# EAGLE design AQ_sensor_GSM (EAGLE 9.6.2)

## Sheet 1 of 2
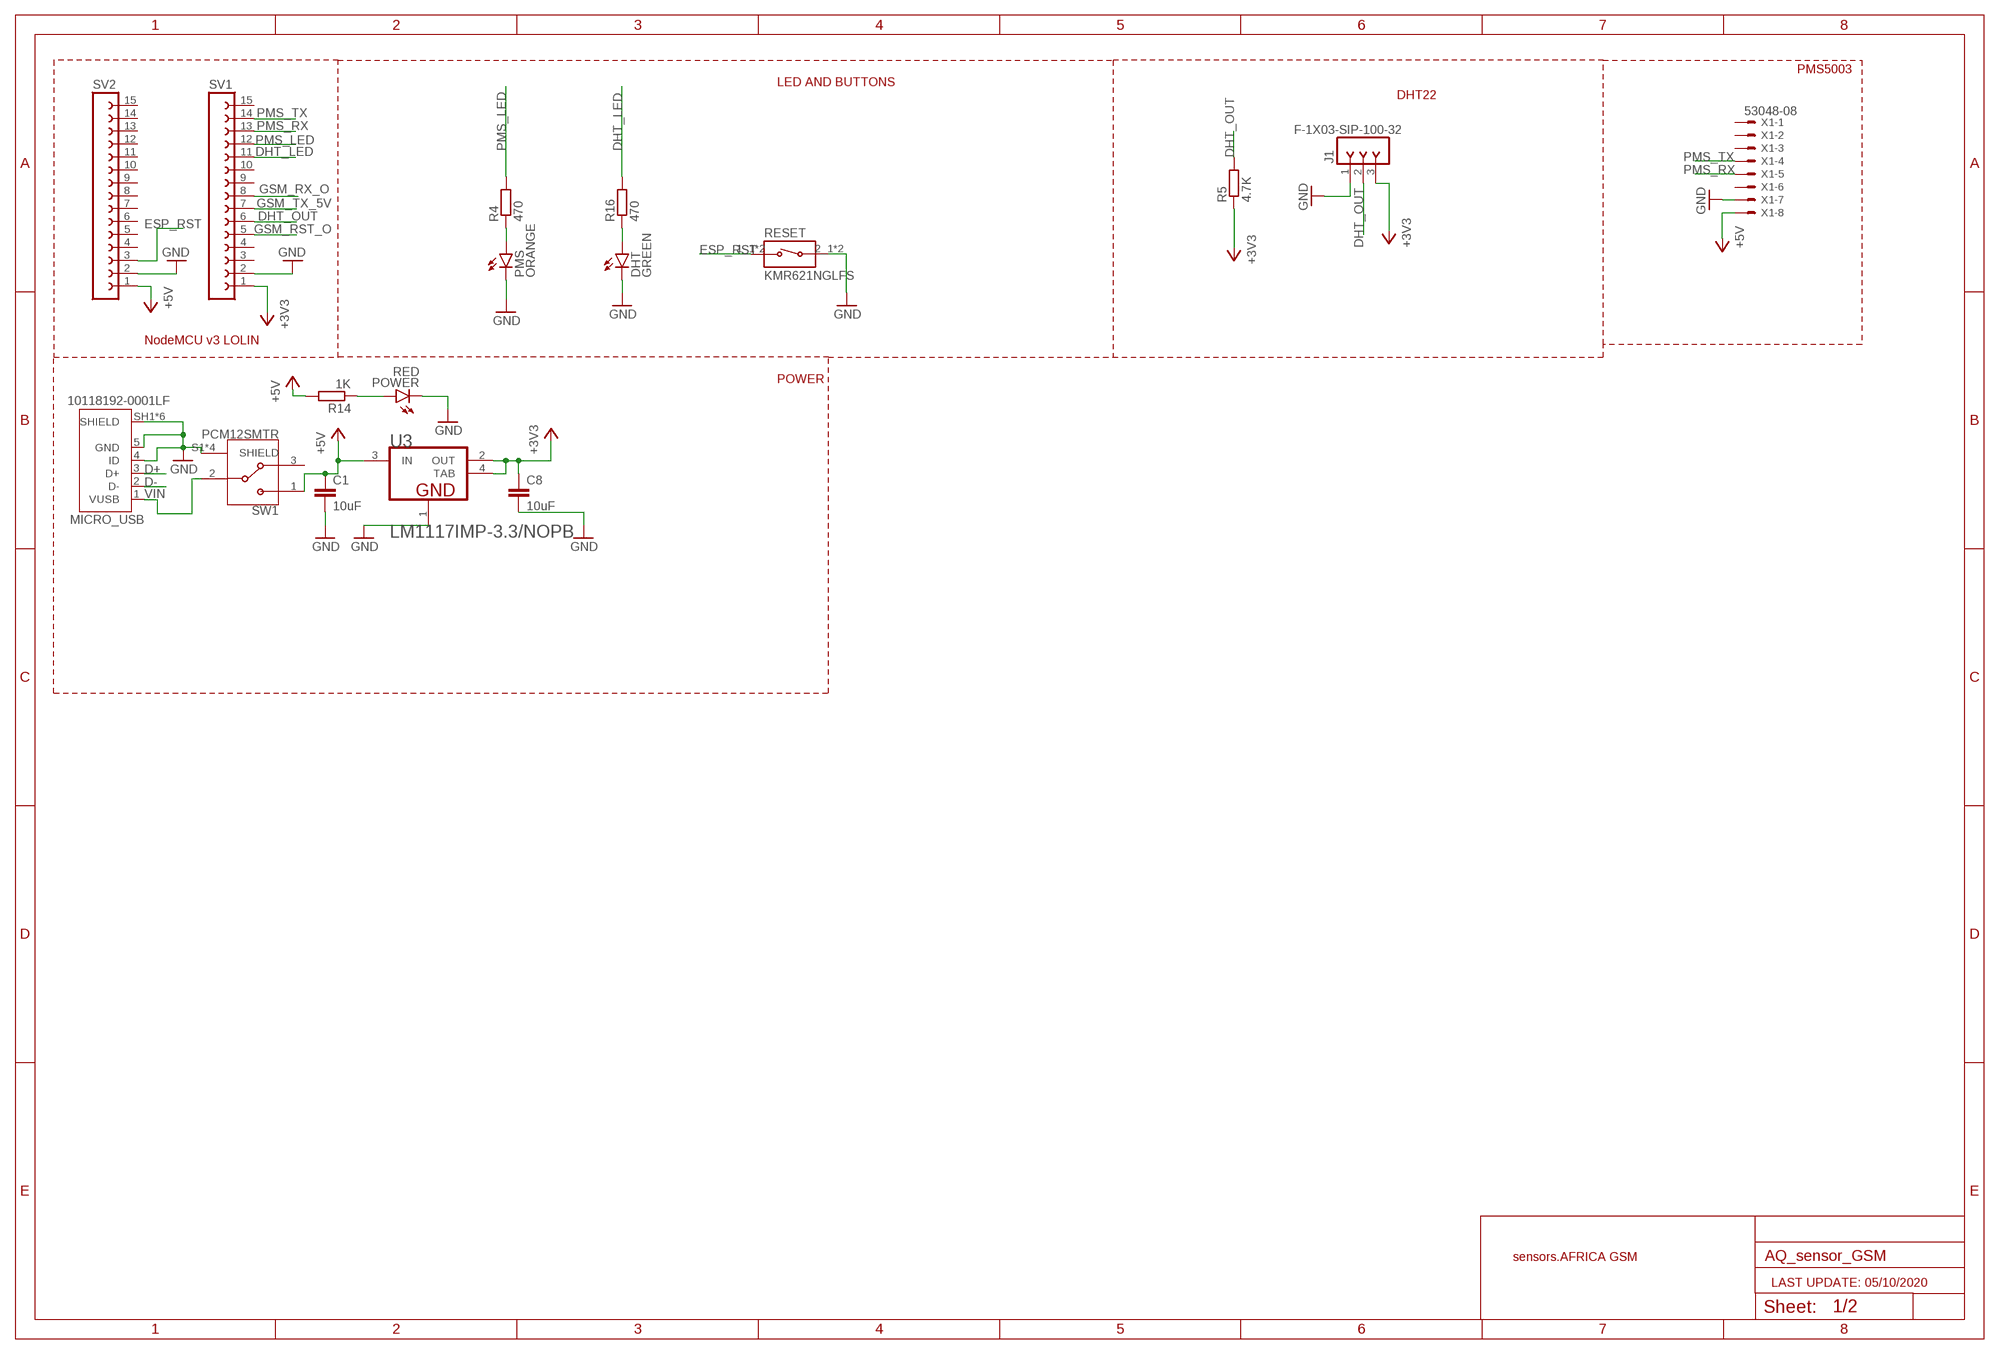
[diagram p0: schematic, sheet 1]

### Parts
C1  10uF  C-EUC0603  [C0603]
C8  10uF  C-EUC0603  [C0603]
DHT  GREEN  LEDCHIP-LED0603  [CHIP-LED0603]
J1  F-1X03-SIP-100-32  [SIP-100-03-32]
MICRO_USB  10118192-0001LF  [AMPHENOL_10118192-0001LF]
PMS  ORANGE  LEDCHIP-LED0603  [CHIP-LED0603]
POWER  RED  LEDCHIP-LED0603  [CHIP-LED0603]
R4  470  R-EU_R0603  [R0603]
R5  4.7K  R-EU_R0603  [R0603]
R14  1K  R-EU_R0603  [R0603]
R16  470  R-EU_R0603  [R0603]
RESET  KMR621NGLFS  [SW_KMR621NGLFS]
SV1  FE15-1  [FE15]
SV2  FE15-1  [FE15]
SW1  PCM12SMTR  [SW_PCM12SMTR]
U3  TEXAS_INSTRUMENTS_LM1117IMP-3.3-NOPBTEXAS_INSTRUMENTS_LM1117IMP-3.3-NOPB_0_0  [TEXAS_INSTRUMENTS_LM1117IMP-3.3-NOPB_0]
X1  53048-08  [53048-08]

### Nets
+3V3 [POWER]: C8.1 J1.3 R5.1 SV1.1 U3.2(OUT) U3.4(TAB)
+5V [POWER]: C1.1 R14.2 SV2.1 SW1.1 U3.3(IN) X1.8 ; also sheet 2
D+: MICRO_USB.3(D+)
D-: MICRO_USB.2(D-)
DHT_LED: R16.2 SV1.11
DHT_OUT: J1.2 R5.2 SV1.6
ESP_RST: RESET.1_1 RESET.1_2 SV2.3
GND [BGA]: C1.2 C8.2 DHT.C J1.1 MICRO_USB.4(ID) MICRO_USB.5(GND) MICRO_USB.SH1(SHIELD) MICRO_USB.SH2(SHIELD) MICRO_USB.SH3(SHIELD) MICRO_USB.SH4(SHIELD) MICRO_USB.SH5(SHIELD) MICRO_USB.SH6(SHIELD) PMS.C POWER.C RESET.2_1 RESET.2_2 SV1.2 SV2.2 SW1.S1(SHIELD) SW1.S2(SHIELD) SW1.S3(SHIELD) SW1.S4(SHIELD) U3.1(GND) X1.7 ; also sheet 2
GSM_RST_O: SV1.5
GSM_RX_O: SV1.8 ; also sheet 2
GSM_TX_5V: SV1.7 ; also sheet 2
N$4: PMS.A R4.1
N$25: POWER.A R14.1
N$27: DHT.A R16.1
PMS_LED: R4.2 SV1.12
PMS_RX: SV1.13 X1.5
PMS_TX: SV1.14 X1.4
VIN: MICRO_USB.1(VUSB) SW1.2
Unconnected: SV1.3 SV1.4 SV1.9 SV1.10 SV1.15 SV2.4 SV2.5 SV2.6 SV2.7 SV2.8 SV2.9 SV2.10 SV2.11 SV2.12 SV2.13 SV2.14 SV2.15 SW1.3 X1.1 X1.2 X1.3 X1.6

### Notes on the sheet
- PMS5003
- LED AND BUTTONS
- DHT22
- NodeMCU v3 LOLIN
- POWER
- sensors.AFRICA GSM
- LAST UPDATE: 05/10/2020

## Sheet 2 of 2
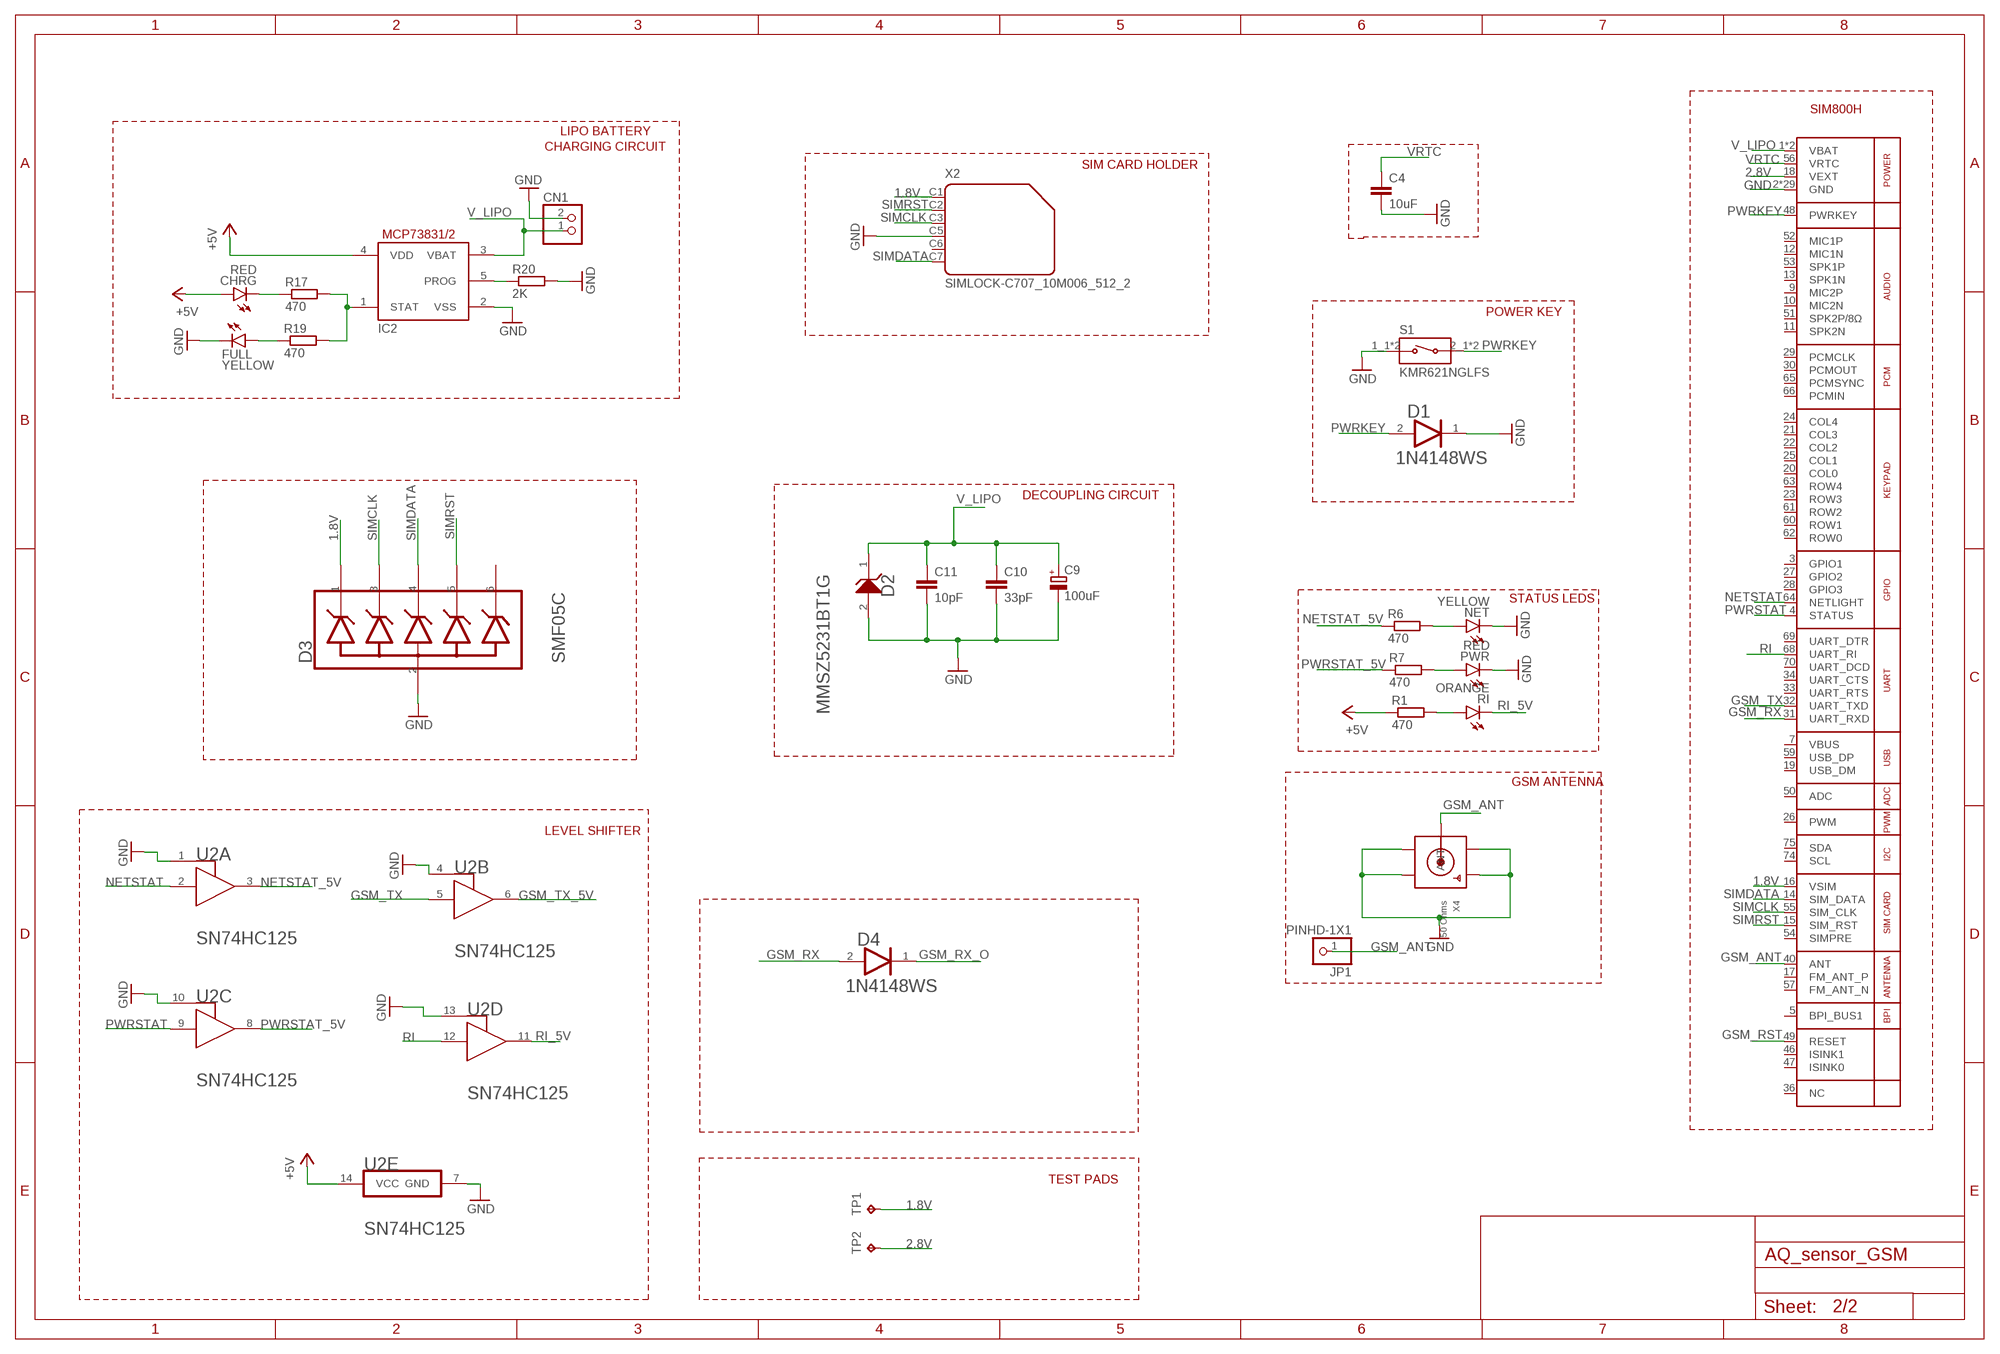
[diagram p1: schematic, sheet 2]

### Parts
C4  10uF  C-EUC0603  [C0603]
C9  100uF  CPOL-EUD  [PANASONIC_D]
C10  33pF  C-EUC0603  [C0603]
C11  10pF  C-EUC0603  [C0603]
CHRG  RED  LEDCHIP-LED0603  [CHIP-LED0603]
CN1  JST_2PIN-SMT-RA  [JST-PH-2-SMT-RA]
D1  ON_SEMI_1N4148WSON_SEMI_1N4148WS_0_0  [ON_SEMI_1N4148WS_0]
D2  ON_SEMICONDUCTOR_MMSZ5231BT1GON_SEMICONDUCTOR_MMSZ5231BT1G_0_0  [ON_SEMICONDUCTOR_MMSZ5231BT1G_0]
D3  SEMTECH_SMF05CSEMTECH_SMF05C_0_0  [SEMTECH_SMF05C_0]
D4  ON_SEMI_1N4148WSON_SEMI_1N4148WS_0_0  [ON_SEMI_1N4148WS_0]
FULL  YELLOW  LEDCHIP-LED0603  [CHIP-LED0603]
IC2  MCP73831/OT  [SOT23-5L]
JP1  PINHD-1X1  [1X01]
NET  YELLOW  LEDCHIP-LED0603  [CHIP-LED0603]
PWR  RED  LEDCHIP-LED0603  [CHIP-LED0603]
R1  470  R-EU_R0603  [R0603]
R6  470  R-EU_R0603  [R0603]
R7  470  R-EU_R0603  [R0603]
R17  470  R-EU_R0603  [R0603]
R19  470  R-EU_R0603  [R0603]
R20  2K  R-EU_R0603  [R0603]
RI  ORANGE  LEDCHIP-LED0603  [CHIP-LED0603]
S1  KMR621NGLFS  [SW_KMR621NGLFS]
TP1  TPB1,27  [B1,27]
TP2  TPB1,27  [B1,27]
U1  GSM_SIM800L  [SIM800L]
U2  TEXAS_INSTRUMENTS_SN74HC125TEXAS_INSTRUMENTS_SN74HC125_0_0  [TEXAS_INSTRUMENTS_SN74HC125_0]
X2  SIMLOCK-C707_10M006_512_2  [C707_10M006_512_2]
X4  50 Ohms  SMACONNECTOR_EDGE_UFL  [SMA_EDGELAUNCH_UFL]

### Nets
1.8V: D3.1(1_CATHODE) TP1.TP U1.16(VSIM) X2.C1
2.8V: TP2.TP U1.18(VEXT)
+5V [POWER]: CHRG.A IC2.4(VDD) R1.1 U2.14(E:VCC) ; also sheet 1
GND [BGA]: C4.2 C9.- C10.2 C11.2 CN1.2 D1.1(CATHODE) D2.2(A) D3.2(ANODE) FULL.C IC2.2(VSS) NET.C PWR.C R20.2 S1.1_1 S1.1_2 U1.2(GND) U1.6(GND) U1.8(GND) U1.35(GND) U1.37(GND) U1.38(GND) U1.39(GND) U1.41(GND) U1.43(GND) U1.44(GND) U1.45(GND) U1.58(GND) U1.67(GND) U1.71(GND) U1.72(GND) U1.73(GND) U1.76(GND) U1.77(GND) U1.78(GND) U1.79(GND) U1.80(GND) U1.81(GND) U1.82(GND) U1.83(GND) U1.84(GND) U1.85(GND) U1.86(GND) U1.87(GND) U1.88(GND) U2.1(A:1_!OE!) U2.4(B:4_!OE!) U2.7(E:GND) U2.10(C:2_!OE!) U2.13(D:3_!OE!) X2.C5 X4.GND@1(GND1) X4.GND@2(GND2) X4.GND@3(GND3) X4.GND@4(GND4) ; also sheet 1
GSM_ANT: JP1.1 U1.40(ANT) X4.P(ANT)
GSM_RST [BGA]: U1.49(RESET)
GSM_RX: D4.2(ANODE) U1.31(UART_RXD)
GSM_RX_O: D4.1(CATHODE) ; also sheet 1
GSM_TX: U1.32(UART_TXD) U2.5(B:2A)
GSM_TX_5V: U2.6(B:2Y) ; also sheet 1
N$6: CHRG.C R17.1
N$9: IC2.1(STAT) R17.2 R19.2
N$10: NET.A R6.2
N$11: PWR.A R7.2
N$12: FULL.A R19.1
N$13: IC2.5(PROG) R20.1
N$14: R1.2 RI.A
NETSTAT [BGA]: U1.64(NETLIGHT) U2.2(A:1A)
NETSTAT_5V: R6.1 U2.3(A:1Y)
PWRKEY [BGA]: D1.2(ANODE) S1.2_1 S1.2_2 U1.48(PWRKEY)
PWRSTAT: U1.4(STATUS) U2.9(C:3A)
PWRSTAT_5V: R7.1 U2.8(C:3Y)
RI [BGA]: U1.68(UART_RI) U2.12(D:4A)
RI_5V: RI.C U2.11(D:4Y)
SIMCLK [BGA]: D3.3(2_CATHODE) U1.55(SIM_CLK) X2.C3
SIMDATA: D3.4(3_CATHODE) U1.14(SIM_DATA) X2.C7
SIMRST: D3.5(4_CATHODE) U1.15(SIM_RST) X2.C2
V_LIPO: C9.+ C10.1 C11.1 CN1.1 D2.1(K) IC2.3(VBAT) U1.1(VBAT) U1.42(VBAT)
VRTC [BGA]: C4.1 U1.56(VRTC)
Unconnected: D3.6(5_CATHODE) U1.3(GPIO1) U1.5(BPI_BUS1) U1.9(MIC2P) U1.10(MIC2N) U1.11(SPK2N) U1.12(MIC1N) U1.13(SPK1N) U1.17(FM_ANT_P) U1.19(USB_DM) U1.20(COL0) U1.21(COL3) U1.22(COL2) U1.23(ROW3) U1.24(COL4) U1.25(COL1) U1.26(PWM) U1.27(GPIO2) U1.28(GPIO3) U1.29(PCMCLK) U1.30(PCMOUT) U1.33(UART_RTS) U1.34(UART_CTS) U1.36(NC) U1.46(ISINK1) U1.47(ISINK0) U1.50(ADC) U1.51(SPK2P/8Ω) U1.52(MIC1P) U1.53(SPK1P) U1.54(SIMPRE) U1.57(FM_ANT_N) U1.59(USB_DP) U1.60(ROW1) U1.61(ROW2) U1.62(ROW0) U1.63(ROW4) U1.65(PCMSYNC) U1.66(PCMIN) U1.69(UART_DTR) U1.70(UART_DCD) U1.74(SCL) U1.75(SDA) X2.C6

### Notes on the sheet
- SIM800H
- LIPO BATTERY
- CHARGING CIRCUIT
- SIM CARD HOLDER
- POWER KEY
- DECOUPLING CIRCUIT
- STATUS LEDS
- GSM ANTENNA
- LEVEL SHIFTER
- TEST PADS

## Power pins joined to a net without a drawn wire
VBUS: U1.7(VBUS)

## Library data of the parts
C1 C4 C8 C10 C11 = rcl:C-EU: CAPACITOR, European symbol; SPICEPREFIX: C
C9 = rcl:CPOL-EU: POLARIZED CAPACITOR, European symbol; SPICEPREFIX: C
CHRG DHT FULL NET PMS POWER PWR RI = led:LED: LED OSRAM: - CHIPLED LG R971, LG N971, LY N971, LG Q971, LY Q971, LO R971, LY R971 LH N974, LH R974 LS Q976, LO Q976, LY Q976 LO Q996 - Hyper CHIPLED LW Q18S LB Q993, LB Q99A, LB R99A - SideLED LS A670, LO A670, LY A670, LG A670, LP A670 LB A673, LV A673, LT A673, LW A673 LH A674 LY A675 LS A676, LA A676, LO A676, LY A676, LW A676 LS A679, LY A679, LG A679 - Hyper Micro SIDELED® LS Y876, LA Y876, LO Y876, LY Y876 LT Y87S - SmartLED LW L88C, LW L88S LB L89C, LB L89S, LG L890 LS L89K, LO L89K, LY L89K LS L896, LA L896, LO L896, LY L896 - TOPLED LS T670, LO T670, LY T670, LG T670, LP T670 LSG T670, LSP T670, LSY T670, LOP T670, LYG T670 LG T671, LOG T671, LSG T671 LB T673, LV T673, LT T673, LW T673 LH T674 LS T676, LA T676, LO T676, LY T676, LB T676, LH T676, LSB T676, LW T676 LB T67C, LV T67C, LT T67C, LS T67K, LO T67K, LY T67K, LW E67C LS E67B, LA E67B, LO E67B, LY E67B, LB E67C, LV E67C, LT E67C LW T67C LS T679, LY T679, LG T679 LS T770, LO T770, LY T770, LG T770, LP T770 LB T773, LV T773, LT T773, LW T773 LH T774 LS E675, LA E675, LY E675, LS T675 LS T776, LA T776, LO T776, LY T776, LB T776 LHGB T686 LT T68C, LB T68C - Hyper Mini TOPLED® LB M676 - Mini TOPLED Santana® LG M470 LS M47K, LO M47K, LY M47K Source: http://www.osram.convergy.de LUXEON: - LUMILED® LXK2-PW12-R00, LXK2-PW12-S00, LXK2-PW14-U00, LXK2-PW14-V00 LXK2-PM12-R00, LXK2-PM12-S00, LXK2-PM14-U00 LXK2-PE12-Q00, LXK2-PE12-R00, LXK2-PE12-S00, LXK2-PE14-T00, LXK2-PE14-U00 LXK2-PB12-K00, LXK2-PB12-L00, LXK2-PB12-M00, LXK2-PB14-N00, LXK2-PB14-P00, LXK2-PB14-Q00 LXK2-PR12-L00, LXK2-PR12-M00, LXK2-PR14-Q00, LXK2-PR14-R00 LXK2-PD12-Q00, LXK2-PD12-R00, LXK2-PD12-S00 LXK2-PH12-R00, LXK2-PH12-S00 LXK2-PL12-P00, LXK2-PL12-Q00, LXK2-PL12-R00 Source: www.luxeon.com KINGBRIGHT: KA-3528ASYC Source: www.kingbright.com
CN1 = AQ_sensor_GSM:JST_2PIN: JST 2-Pin Connectors of various flavors SMT-RA (S2B-PH-SM4) 4UConnector #17311 SMT (B2B-PH-SM4) THM-RA (S2B-PH) THM (B2B-PH)
D1 D4 = AQ_sensor_GSM:ON_SEMI_1N4148WS: Small Signal Diodes; CENTROID_NOT_SPECIFIED: No; DATASHEET: https://www.fairchildsemi.com/datasheets/1N/1N4148WS.pdf; DIGIKEY_DESCRIPTION: DIODE GEN PURP 75V 150MA SOD323F; DIGIKEY_PART_NUMBER: 1N4148WSFSCT-ND; IPC_LAND_PATTERN_NAME: SOD250125X70-2; LEAD_FREE: yes; MF: ON Semi; MFG_PACKAGE_IDENT: CASE 477AB; MOUSER_DESCRIPTION: Diodes - General Purpose, Power, Switching Small Signal Diode; MOUSER_PART_NUMBER: 512-1N4148WS; MPN: 1N4148WS; PACKAGE: SOD-323FL; PREFIX: D; ROHS: yes; TEMPERATURE_RANGE_HIGH: +150°C
D2 = AQ_sensor_GSM:ON_SEMICONDUCTOR_MMSZ5231BT1G: ONSC-K1A2-2; CIIVA_IDS: 804101; COMPONENT_LINK_1_DESCRIPTION: Manufacturer URL; COMPONENT_LINK_1_URL: http://www.onsemi.com/; COMPONENT_LINK_3_DESCRIPTION: Package Specification; COMPONENT_LINK_3_URL: http://www.onsemi.com/pub_link/Collateral/425-04.PDF; DATASHEET: http://www.onsemi.com/pub_link/Collateral/MMSZ5221BT1-D.PDF; DATASHEET_VERSION: Rev. 12; FOOTPRINT_VARIANT_NAME_0: Manufacturer Recommended; IMPORTED: yes; IMPORTED_FROM: vault; IMPORT_TS: 1521844429; MF: On Semiconductor; MOUNTING_TECHNOLOGY: Surface Mount; MPN: MMSZ5231BT1G; PACKAGE: SOD-123-2-425-04; PACKAGE_DESCRIPTION: 2-Pin SOD, Body 1.6 x 2.69 mm; PACKAGE_VERSION: Rev. G, 10/2009; PACKING: Tape and Reel; PREFIX: D; P_MAX_W: 0.5; RELEASE_DATE: 1407150685; ROHS: No; VAULT_GUID: 27F6BF34-1EB2-4973-A1B4-1410F52D084D; VAULT_REVISION: BBBB861B-93F7-43FE-93E6-D586C34E6C45; VZ_TYP_V: 5.1
D3 = AQ_sensor_GSM:SEMTECH_SMF05C: TVS Diode Array; CENTROID_NOT_SPECIFIED: No; DATASHEET: http://www.semtech.com/images/datasheet/smf05c.pdf; DIGIKEY_DESCRIPTION: DIODE TVS DIODE 5VWM 12.5VC SC70-6; DIGIKEY_PART_NUMBER: SMF05CCT-ND; JUNCTION_CAPACITANCE: 130pF max; LEAD_FREE: yes; MANUFACTURER_PRODUCT_PAGE: http://www.semtech.com/apps/product.php?pn=SMF05C; MF: Semtech; MFG_PACKAGE_IDENT: SC70-6L; MOUSER_PART_NUMBER: 947-SMF05C.TCT; MPN: SMF05C; PACKAGE: SC-70-6; PREFIX: D; REVERSE_STAND-OFF_VOLTAGE: 5V; ROHS: yes; TEMPERATURE_RANGE_HIGH: +125°C; TEMPERATURE_RANGE_LOW: -55°C
IC2 = AQ_sensor_GSM:MCP73831: MCP73831/2 Miniature Single-Cell, Fully Integrated Li-Ion, Li-Polymer Charge Management Controllers. Nice and small simple lipoly charge controller, with adjustable current and status output (LED) http://www.ladyada.net/library/pcb/eaglelibrary.html
J1 = AQ_sensor_GSM:F-1X03-: FEMALE HEADER
JP1 = Connector:PINHD-1X1: PIN HEADER; CATEGORY: Headers; DESCRIPTION: Header, Straight, 1 Position; MANUFACTURER: Generic; MPN: Generic; OPERATING_TEMPERATURE: Generic; PART_STATUS: Active; PITCH: 0.100" (2.54mm); ROHS_COMPLIANCE: Generic; SERIES: Generic; SUB-CATEGORY: Headers, Male Pins; TYPE: Board to Board or Cable, Unshrouded, Through Hole, Straight
MICRO_USB = AQ_sensor_GSM:10118192-0001LF: Single Port 5 Contact Horizontal Right Angle Shielded Micro B USB 2.0 Connector; AVAILABILITY: Unavailable; DESCRIPTION: USB - micro B USB 2.0 Receptacle Connector 5 Position Surface Mount, Right Angle; MF: Amphenol ICC; MP: 10118192-0001LF; PACKAGE: None; PRICE: None
R1 R4-R7 R14 R16 R17 R19 R20 = rcl:R-EU_: RESISTOR, European symbol; SPICEPREFIX: R
RESET = KMR621NGLFS:KMR621NGLFS: Tactile Switches 50mA 32VDC 1.9mmH 2N IP67 Check availability <https://pricing.snapeda.com/parts/KMR621NG%20LFS/C%26K/view-part?ref=eda>; AVAILABILITY: In Stock; DESCRIPTION: Tactile Switch SPST-NO Top Actuated Surface Mount; MF: C&K; MP: KMR621NG LFS; PACKAGE: None; PRICE: None; PURCHASE-URL: https://pricing.snapeda.com/search?q=KMR621NG LFS&ref=eda
S1 = AQ_sensor_GSM:KMR621NGLFS: Tactile Switches 50mA 32VDC 1.9mmH 2N IP67; AVAILABILITY: Unavailable; DESCRIPTION: Tactile Switch SPST-NO Top Actuated Surface Mount; MF: C&K; MP: KMR621NG LFS; PACKAGE: None; PRICE: None
SV1 SV2 = AQ_sensor_GSM:FE15-1: FEMALE HEADER; OC_FARNELL: unknown; OC_NEWARK: unknown
SW1 = AQ_sensor_GSM:PCM12SMTR: Switch Slide ON ON SPDT Side Slide 0.3A 6VDC 10000Cycles Gull Wing SMD T/R; AVAILABILITY: Unavailable; DESCRIPTION: Slide Switch SPDT Surface Mount, Right Angle; MF: C&K; MP: PCM12SMTR; PACKAGE: DO-201 C&amp;K Components; PRICE: None
TP1 TP2 = testpad:TP: Test pad
U1 = AQ_sensor_GSM:GSM_SIM800L: SIM800K Quad-Band GSM/GPRS Module 850/900/1800/1900 MHz Bluetooth EDR (3.0) FM Band: 76-109MHz (50kHz steps) -40 - 85°C
U2 = AQ_sensor_GSM:TEXAS_INSTRUMENTS_SN74HC125: TI-SN74HC125-D0014A-14; BITS: 4; CIIVA_IDS: 1347642; CODE__JEDEC: MS-012; DATASHEET_VERSION: SCLS104D; FOOTPRINT_VARIANT_NAME_0: Level C; FOOTPRINT_VARIANT_NAME_1: Level B; FOOTPRINT_VARIANT_NAME_2: Level A; F__NOM_VOLTAGEMAXMHZ: 28; ICC__NOM_VOLTAGEMAXMA: 0.16; IMPORTED: yes; IMPORTED_FROM: vault; IMPORT_TS: 1521847871; INPUT_TYPE: CMOS; MF: Texas Instruments; MPN: SN74HC125; OPERATING_TEMPERATURE_RANGEC: -40 to 85; OUTPUT_TYPE: CMOS; PACKAGE: D0014A; PACKAGE_VERSION: http://www.ti.com/lit/ml/mpds177g/mpds177g.pdf; PIN_0_0_0_OUTSIDE_EDGE: dot; PIN_0_1_0_OUTSIDE_EDGE: dot; PIN_0_2_0_OUTSIDE_EDGE: dot; PIN_0_3_2_OUTSIDE_EDGE: dot; PREFIX: U; RATING: Catalog; RELEASE_DATE: 1459237643; TPD__NOM_VOLTAGEMAXNS: 26; VAULT_GUID: 3C6FD517-640E-4127-B90A-BA192E753297; VAULT_REVISION: 33E4D10A-39F8-41E5-8A10-D32CFAC933D3; VCC_MAX_V: 6; VCC_MIN_V: 2; VOLTAGE_NOM_V: 6
U3 = AQ_sensor_GSM:TEXAS_INSTRUMENTS_LM1117IMP-3.3-NOPB: PM-REG-LM1086-SOT4; CIIVA_IDS: 19361124; CODE__IPC: SOT223-4; CODE__JEDEC: TO-261-AA; COMPONENT_LINK_1_DESCRIPTION: Datasheet URL; COMPONENT_LINK_1_URL: http://www.ti.com/general/docs/lit/getliterature.tsp?genericPartNumber=LM1117-N&fileType=pdf; COMP_TYPE: LDO IC; FOOTPRINT_VARIANT_NAME_0: Level C; FOOTPRINT_VARIANT_NAME_1: Level B; FOOTPRINT_VARIANT_NAME_2: Level A; HIGH__RELIABILITY: Y; IMPORTED: yes; IMPORTED_FROM: vault; IMPORT_TS: 1521845365; MF: Texas Instruments; MPN: LM1117IMP-3.3/NOPB; PACKAGE: DCY0004A; PACKAGE_DESCRIPTION: Molded SOT-223, 6.50 x 3.56 x 1.6mm Body, 4 Lead, 2.3mm Pitch; PACKAGE_TOP_MARKING: XYTT*N05B; PIN_COUNT: 4; POWER_WISE: N; PREFIX: U; RELEASE_DATE: 1464077430; ROHS: Yes; VAULT_GUID: 7E820BF6-F141-44C1-8A74-392CB201F257; VAULT_REVISION: 16019014-2FBF-4157-ADF5-B132B4DC413A
X1 = AQ_sensor_GSM:53?-08: CONNECTOR wire to board 1.25 mm (.049 inch) pitch header; MF: WALDOM/MOLEX; MPN: 53048-0810; OC_FARNELL: 9733094; OC_NEWARK: 38C9913
X2 = AQ_sensor_GSM:SIMLOCK-C707_10M006_512_2: C707A SIMLOCK® 2.5 mm with wide solder tails Source: Data sheet <http://www.amphenol.info/downloads/C707_10M006_512_2.pdf>; OC_FARNELL: unknown; OC_NEWARK: unknown
X4 = AQ_sensor_GSM:SMACONNECTOR: SMA Connector 90° DIP SMA Connector, 50 Ohm (4UConnector: 07259)

## Net classes
0 default: width 0.3 mm, drill 0.3 mm, clearance 0.2 mm
1 POWER: width 0.4 mm, drill 0.3 mm, clearance 0.2 mm to class 0, clearance 0.2 mm

## Board
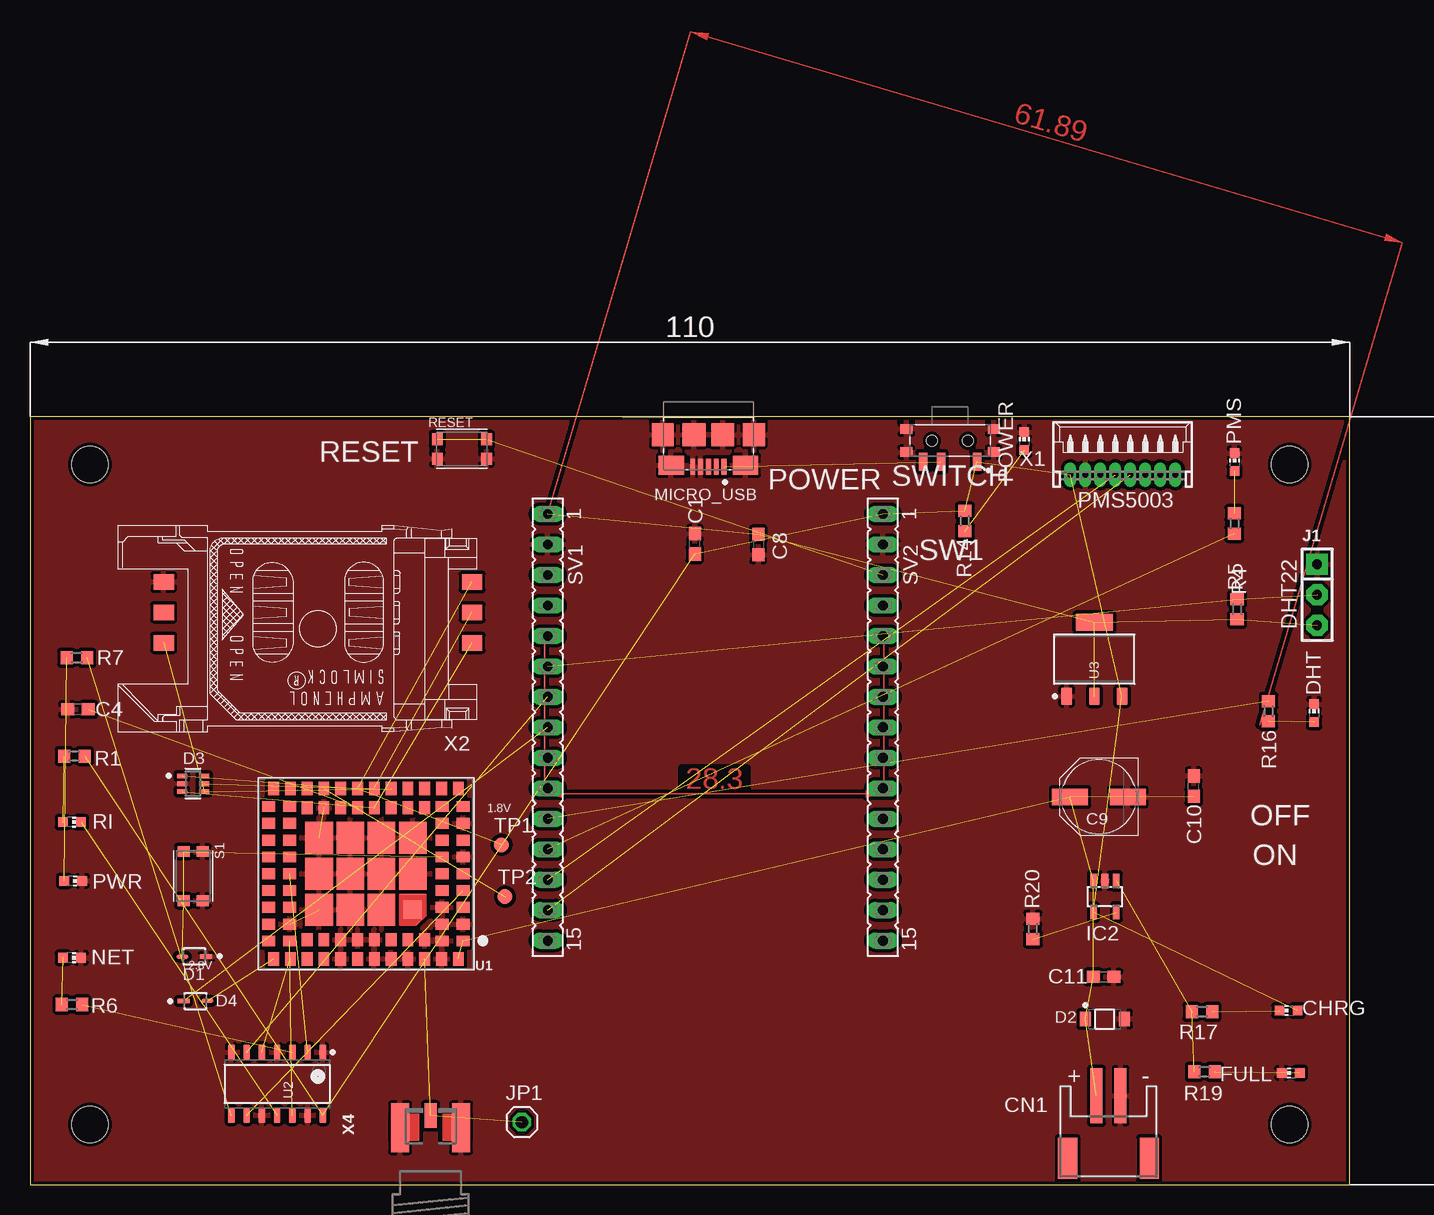
[diagram p2: board, top side]
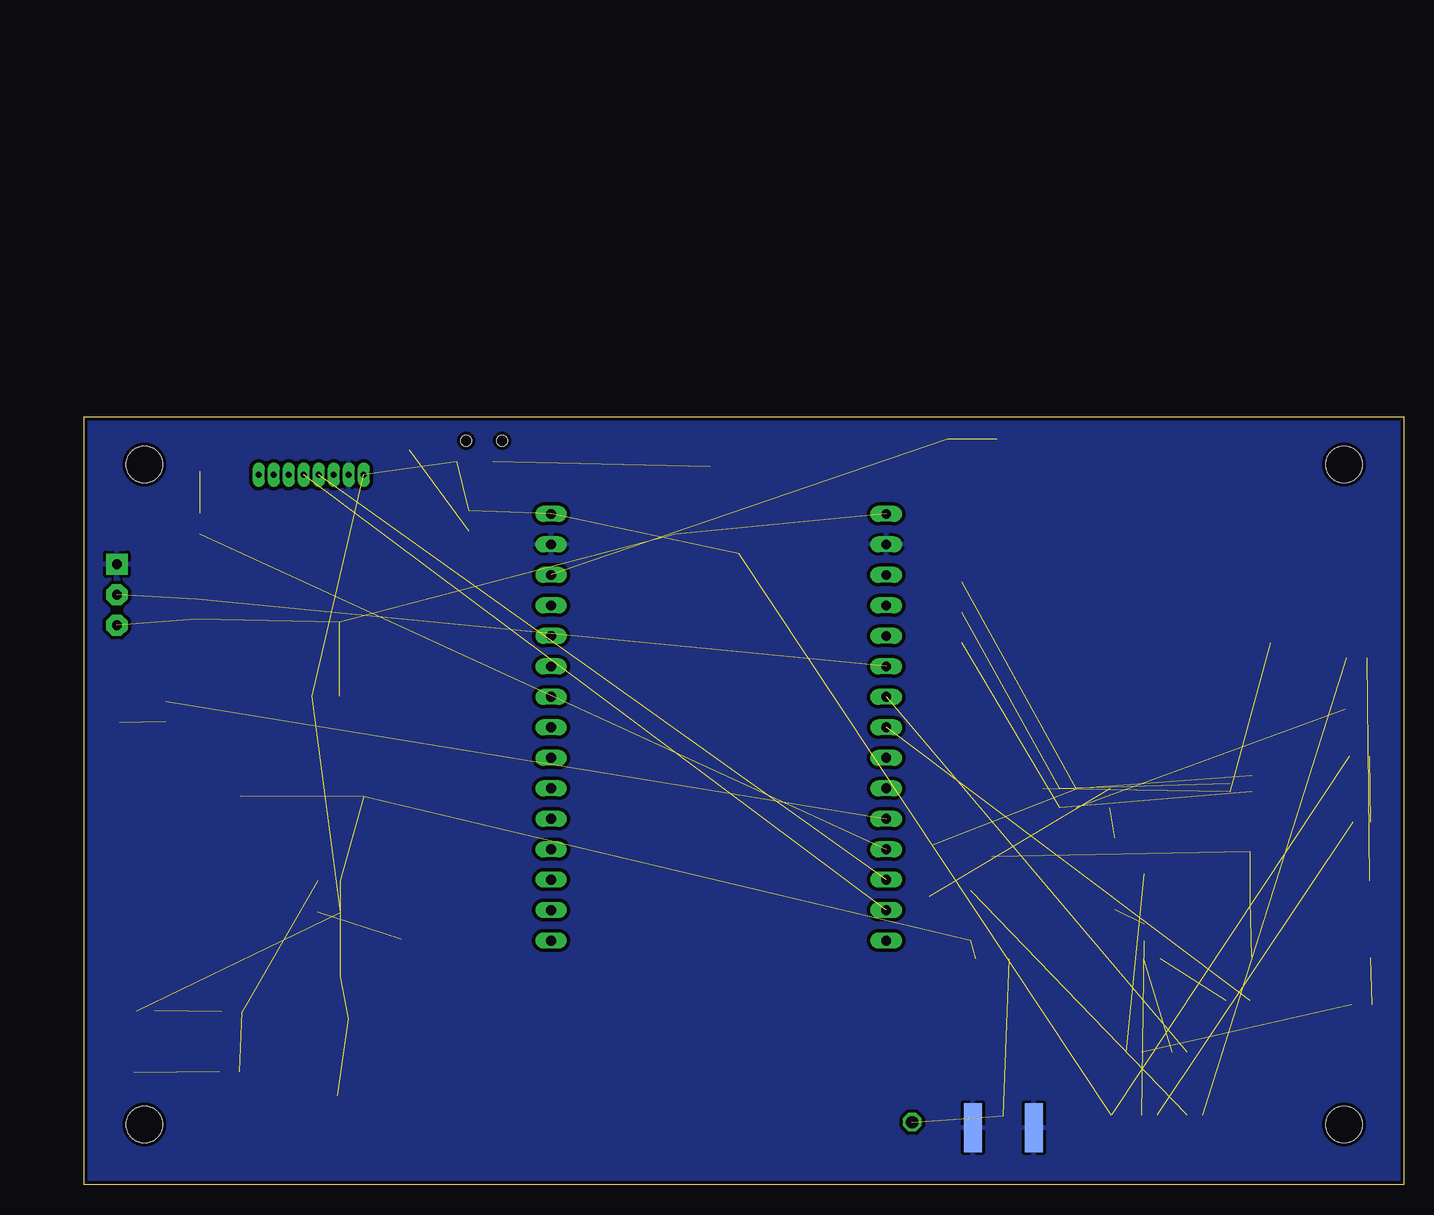
[diagram p3: board, bottom side, seen from below]

Size 110 x 64 mm. Coordinates in mm from the lower left corner, seen from the top.
Outline: 0,0 110,0 110,64 0,64 0,0
Copper layers (1*16): Top 0.035mm / dielectric 1.5mm / Bottom 0.035mm
Design rules "default *": minimum track width 0.1mm, minimum drill 0.15mm, track to track 0.3mm, track to pad 0.1mm, pad to pad 0.2mm, via to via 0.3mm, smd to smd 0.3mm, copper to edge 0.3mm, drill to drill 0.3mm, minimum pad ring 10mil, minimum via ring 8mil, stop-mask expansion 4mil, vias tented up to drill 0mil, thermal gap 10mil
Holes 3 mm at 5,60 5,5 105,5 105,60

### Footprints (pad centres in the part's own frame; a part is rotated, then mirrored left to right if it is on the bottom)
C0603 = smd 1.1 x 1: 1 -0.85,0; 2 0.85,0
PANASONIC_D = smd 3 x 1.4: + 2.4,0; - -2.4,0
CHIP-LED0603 = smd 0.8 x 0.8: A 0,-0.75; C 0,0.75
JST-PH-2-SMT-RA = smd 1 x 4.6: 1 1,-3.7; 2 -1,-3.7 | smd 1.6 x 3.4: NC1 -3.4,1.5; NC2 3.4,1.5
ON_SEMI_1N4148WS_0 = smd 1.006 x 0.392: 1 -1,0; 2 1,0
ON_SEMICONDUCTOR_MMSZ5231BT1G_0 = smd 0.91 x 1.22: 1 -1.635,0; 2 1.635,0
SEMTECH_SMF05C_0 = smd 0.85 x 0.4: 1 -0.925,0.65; 2 -0.925,0; 3 -0.925,-0.65; 4 0.925,-0.65; 5 0.925,0; 6 0.925,0.65
SOT23-5L = smd 0.55 x 1.2: 1 -0.95,-1.3; 2 0,-1.3; 3 0.95,-1.3; 4 0.95,1.3; 5 -0.95,1.3
SIP-100-03-32 = drill 0.813 pad 1.778 square: 1 -2.54,0 | drill 0.813 pad 1.778 octagon: 2 0,0; 3 2.54,0
1X01 = drill 1.016 octagon: 1 0,0
AMPHENOL_10118192-0001LF = smd 0.4 x 1.35: 1 -1.3,0; 2 -0.65,0; 3 0,0; 4 0.65,0; 5 1.3,0 | smd 2.1 x 1.6: SH1 -3.1,-0.125; SH2 3.1,-0.125 | smd 1.8 x 1.9: SH3 -3.8,-2.675; SH6 3.8,-2.675 | smd 1.9 x 1.9: SH4 -1.2,-2.675; SH5 1.2,-2.675
R0603 = smd 1 x 1.1: 1 -0.85,0; 2 0.85,0
SW_KMR621NGLFS = smd 0.9 x 1: 1_1 -2.05,0.8; 1_2 2.05,0.8; 2_1 -2.05,-0.8; 2_2 2.05,-0.8
FE15 = drill 0.813 long: 1 -17.78,0; 2 -15.24,0; 3 -12.7,0; 4 -10.16,0; 5 -7.62,0; 6 -5.08,0; 7 -2.54,0; 8 0,0; 9 2.54,0; 10 5.08,0; 11 7.62,0; 12 10.16,0; 13 12.7,0; 14 15.24,0; 15 17.78,0
SW_PCM12SMTR = smd 0.7 x 1.5: 1 -2.25,1.75; 2 0.75,1.75; 3 2.25,1.75 | smd 1 x 0.8: S1 -3.65,0.965; S2 -3.65,-0.965; S3 3.65,-0.965; S4 3.65,0.965 | hole 0.9: -1.5,0; 1.5,0
B1,27 = smd 1.27 x 1.27: TP 0,0
SIM800L = smd 1.1 x 0.9: 1 -8.1,5.6; 2 -8.1,4.2; 3 -8.1,2.8; 4 -8.1,1.4; 5 -8.1,0; 6 -8.1,-1.4; 7 -8.1,-2.8; 8 -8.1,-4.2; 9 -8.1,-5.6; 22 8.1,-5.6; 23 8.1,-4.2; 24 8.1,-2.8; 25 8.1,-1.4; 26 8.1,0; 27 8.1,1.4; 28 8.1,2.8; 29 8.1,4.2; 30 8.1,5.6; 43 -6.36,5.6; 44 -6.36,4.2; 45 -6.36,2.8; 46 -6.36,1.4; 47 -6.36,0; 48 -6.36,-1.4; 49 -6.36,-2.8; 50 -6.36,-4.2; 51 -6.36,-5.6; 60 6.36,-5.6; 61 6.36,-4.2; 62 6.36,-2.8; 63 6.36,-1.4; 64 6.36,0; 65 6.36,1.4; 66 6.36,2.8; 67 6.36,4.2; 68 6.36,5.6 | smd 0.9 x 1.1: 10 -7.7,-7.1; 11 -6.3,-7.1; 12 -4.9,-7.1; 13 -3.5,-7.1; 14 -2.1,-7.1; 15 -0.7,-7.1; 16 0.7,-7.1; 17 2.1,-7.1; 18 3.5,-7.1; 19 4.9,-7.1; 20 6.3,-7.1; 21 7.7,-7.1; 31 7.7,7.1; 32 6.3,7.1; 33 4.9,7.1; 34 3.5,7.1; 35 2.1,7.1; 36 0.7,7.1; 37 -0.7,7.1; 38 -2.1,7.1; 39 -3.5,7.1; 40 -4.9,7.1; 41 -6.3,7.1; 42 -7.7,7.1; 52 -4.9,-5.5; 53 -3.5,-5.5; 54 -2.1,-5.5; 55 -0.7,-5.5; 56 0.7,-5.5; 57 2.1,-5.5; 58 3.5,-5.5; 59 4.9,-5.5; 69 4.9,5.5; 70 3.5,5.5; 71 2.1,5.5; 72 0.7,5.5; 73 -0.7,5.5; 74 -2.1,5.5; 75 -3.5,5.5; 76 -4.9,5.5 | smd 1.5 x 1.5: 77 -3.9,3 | smd 2.3 x 2.7: 78 -3.9,0; 79 -3.9,-3; 80 -1.3,-3; 81 1.3,-3; 82 3.9,-3; 83 3.9,0; 84 3.9,3; 85 1.3,3; 86 -1.3,3; 87 -1.3,0; 88 1.3,0
TEXAS_INSTRUMENTS_SN74HC125_0 = smd 1.25 x 0.55: 1 -2.625,3.81; 2 -2.625,2.54; 3 -2.625,1.27; 4 -2.625,0; 5 -2.625,-1.27; 6 -2.625,-2.54; 7 -2.625,-3.81; 8 2.625,-3.81; 9 2.625,-2.54; 10 2.625,-1.27; 11 2.625,0; 12 2.625,1.27; 13 2.625,2.54; 14 2.625,3.81
TEXAS_INSTRUMENTS_LM1117IMP-3.3-NOPB_0 = smd 1.45 x 0.9: 1 -3.075,2.3; 2 -3.075,0; 3 -3.075,-2.3 | smd 1.45 x 3.15: 4 3.075,0
53048-08 = drill 0.5 pad 0.698 long: 1 4.375,-1.25; 2 3.125,-1.25; 3 1.875,-1.25; 4 0.625,-1.25; 5 -0.625,-1.25; 6 -1.875,-1.25; 7 -3.125,-1.25; 8 -4.375,-1.25
C707_10M006_512_2 = smd 1.7 x 1.3: C1 -12.85,-3.915; C2 -12.85,-1.375; C3 -12.85,1.165; C5 12.85,-3.915; C6 12.85,-1.375; C7 12.85,1.165
SMA_EDGELAUNCH_UFL = smd 4.064 x 1.524: GND@1 2.032,-2.54; GND@2 2.032,2.54 | smd 4.064 x 1.524 bottom: GND@3 2.032,2.54; GND@4 2.032,-2.54 | smd 2.032 x 1.016: P 3.048,0

### Placement (x,y rotation side)
C1  55.42,53.4 90 top
C4  4,39.6 180 top
C8  60.72,53.33 270 top
C9  89.1,32.3 180 top
C10  97,33.2 90 top
C11  89.5,17.3 0 top
CHRG  104.9,14.5 90 top
CN1  89.9,3.7 180 top
D1  13.7,19 180 top
D2  89.6,13.8 0 top
D3  13.6,33.4 0 top
D4  13.8,15.3 0 top
DHT  107.04,39.29 0 top
FULL  105.1,9.3 90 top
IC2  89.6,24 180 top
J1  107.3,49.15 270 top
JP1  41,5.2 0 top
MICRO_USB  56.55,59.81 180 top
NET  3.5,18.9 270 top
PMS  100.41,60.2 0 top
POWER  82.89,61.96 0 top
PWR  3.6,25.3 270 top
R1  3.7,35.7 180 top
R4  100.4,55.09 270 top
R5  100.63,47.94 90 top
R6  3.5,15 180 top
R7  3.9,43.9 180 top
R14  77.93,55.29 90 top
R16  103.24,39.44 90 top
R17  97.7,14.4 180 top
R19  97.9,9.4 180 top
R20  83.6,21.3 90 top
RESET  36,61.3 0 top
RI  3.5,30.2 270 top
S1  13.6,25.7 270 top
SV1  43.16,38.1 270 top
SV2  71.1,38.1 270 top
SW1  76.7,62 180 top
TP1  39.3,28.3 0 top
TP2  39.6,24 0 top
U1  28,25.9 180 top
U2  20.6,8.4 270 top
U3  88.73,43.78 90 top
X1  91.09,60.4 0 top
X2  24,46.3 180 top
X4  33.4,2.7 90 top

### Tracks (layer width: path | path; a pad name or v marks a point on that pad's centre or on a via)
1.8V  (3 unrouted)
2.8V  (1 unrouted)
+3V3  (5 unrouted)
+5V  (9 unrouted)
DHT_LED  (1 unrouted)
DHT_OUT  (2 unrouted)
ESP_RST  (2 unrouted)
GND  (2 unrouted)
  pour Top: 0,0 110,0 110,64 0,64
  pour Bottom: 0,0 109.9,0 110,64 0,64
GSM_ANT  (2 unrouted)
GSM_RX  (1 unrouted)
GSM_RX_O  (1 unrouted)
GSM_TX  (1 unrouted)
GSM_TX_5V  (1 unrouted)
N$4  (1 unrouted)
N$6  (1 unrouted)
N$9  (2 unrouted)
N$10  (1 unrouted)
N$11  (1 unrouted)
N$12  (1 unrouted)
N$13  (1 unrouted)
N$14  (1 unrouted)
N$25  (1 unrouted)
N$27  (1 unrouted)
NETSTAT  (1 unrouted)
NETSTAT_5V  (1 unrouted)
PMS_LED  (1 unrouted)
PMS_RX  (1 unrouted)
PMS_TX  (1 unrouted)
PWRKEY  (3 unrouted)
PWRSTAT  (1 unrouted)
PWRSTAT_5V  (1 unrouted)
RI  (1 unrouted)
RI_5V  (1 unrouted)
SIMCLK  (2 unrouted)
SIMDATA  (2 unrouted)
SIMRST  (2 unrouted)
V_LIPO  (7 unrouted)
VIN  (1 unrouted)
VRTC  (1 unrouted)
(copper drawn outside any net)
  shapes: Top area x2

### Text on the board
tPlace: RESET | POWER | SWITCH | /Users/kirah/Downloads/Logo-Files-01.bmp
tNames: PMS5003 | DHT22 | 1.8V | OFF | ON | 2.8V